# Altium schematic sheet CAN.SchDoc
size A4
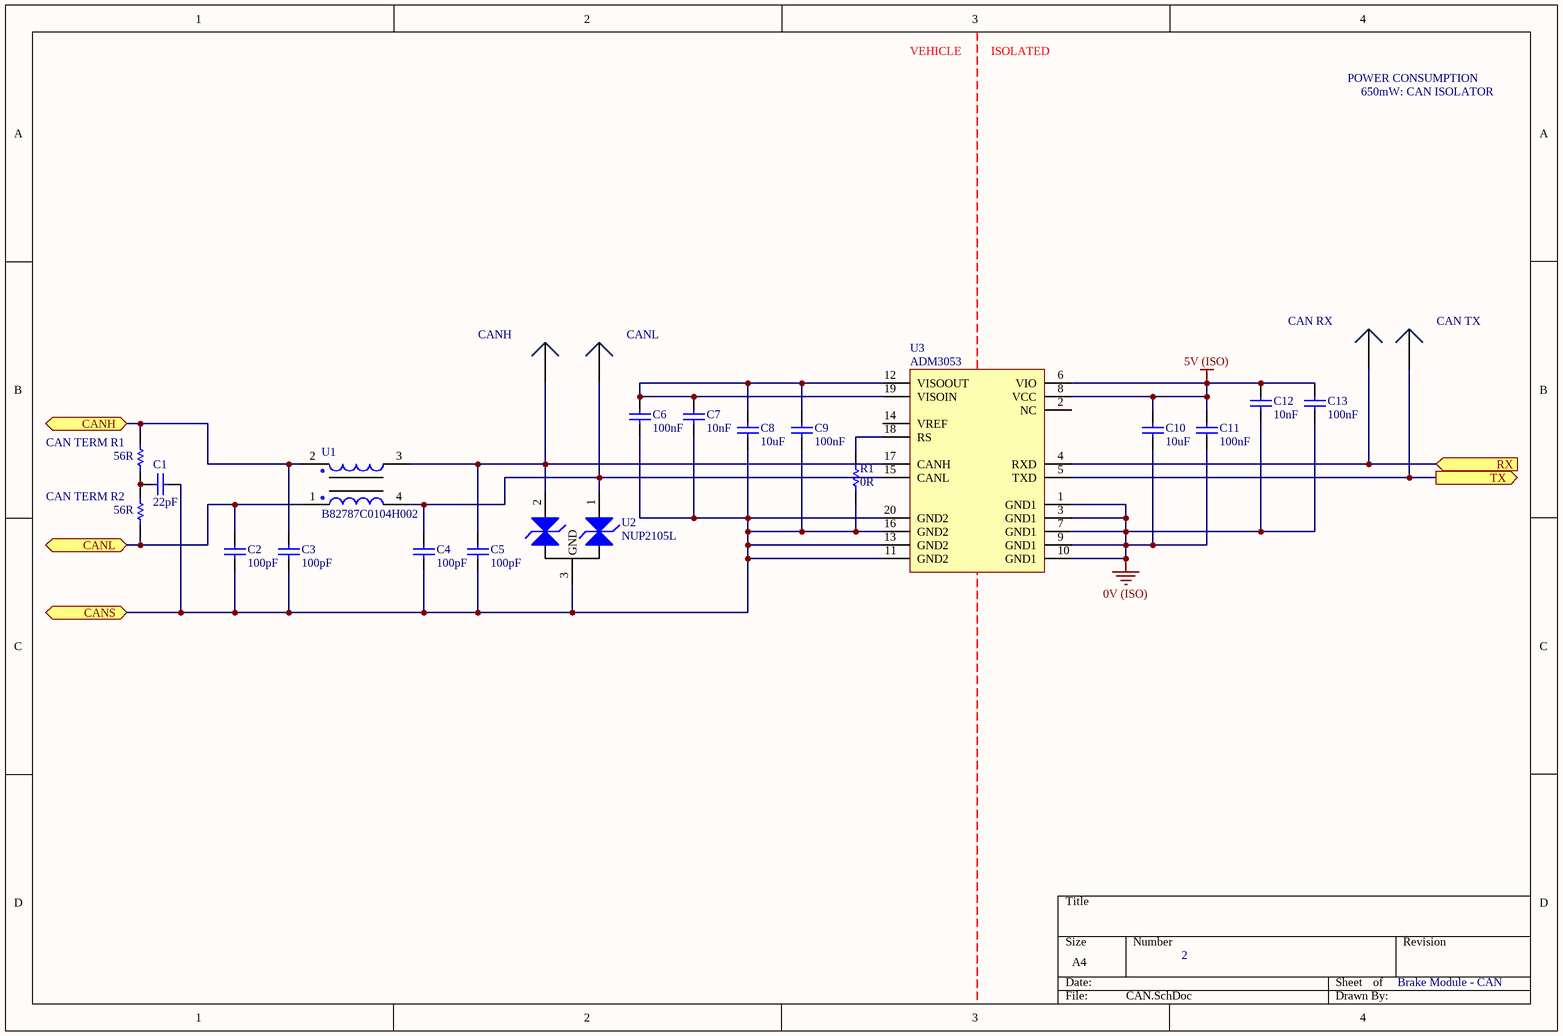
[diagram p0: CAN.SchDoc]

## Parts
C1  22pF  [0805]
C2  100pF  [0805]
C3  100pF  [0805]
C4  100pF  [0805]
C5  100pF  [0805]
C6  100nF  [0805]
C7  10nF  [1206]
C8  10uF  [0805]
C9  100nF  [0805]
C10  10uF  [0805]
C11  100nF  [0805]
C12  10nF  [1206]
C13  100nF  [0805]
CAN_RX  0mm  [SMD Test Point]  (value not drawn)
CAN_TERM_R1  56R  [0805]
CAN_TERM_R2  56R  [0805]
CAN_TX  0mm  [SMD Test Point]  (value not drawn)
CANH  0mm  [SMD Test Point]  (value not drawn)
CANL  0mm  [SMD Test Point]  (value not drawn)
R1  0R  [0805]
U1  B82787C0104H002  [TDK 4-PC Pad]
U2  NUP2105L  [ON SOT-23]
U3  ADM3053  [AD SOIC-W 20]

## Ports
CANH (bidir), CANL (bidir), CANS (bidir), RX (in), TX (out)

## Nets
0V (ISO): C10.1 C11.1 C12.1 C13.1 U3.1(GND1) U3.3(GND1) U3.7(GND1) U3.9(GND1) U3.10(GND1)
5V (ISO): C10.2 C11.2 C12.2 C13.2 U3.6(VIO) U3.8(VCC)
CANH: C3.2 CAN_TERM_R1.2 U1.2 ; port CANH
CANL: C2.2 CAN_TERM_R2.1 U1.1 ; port CANL
CANS: C1.2 C2.1 C3.1 C4.1 C5.1 C6.1 C7.1 C8.1 C9.1 R1.1 U2.3(GND) U3.11(GND2) U3.13(GND2) U3.16(GND2) U3.20(GND2) ; port CANS
RX: CAN_RX.1 U3.4(RXD) ; port RX
TX: CAN_TX.1 U3.5(TXD) ; port TX
NetC1_1: C1.1 CAN_TERM_R1.1 CAN_TERM_R2.2
NetC4_2: C4.2 CANL.1 U1.4 U2.1(CAN_H) U3.15(CANL)
NetC5_2: C5.2 CANH.1 U1.3 U2.2(CAN_L) U3.17(CANH)
NetC6_2: C6.2 C7.2 C8.2 C9.2 U3.12(VISOOUT) U3.19(VISOIN)
NetR1_2: R1.2 U3.18(RS)

Not connected (* = marked no-connect by the designer): U3 2(NC) 14(VREF)

## Notes on the sheet
- VEHICLE
- ISOLATED
- POWER CONSUMPTION
- 650mW: CAN ISOLATOR
- 2
- Brake Module - CAN

## Library data of the parts
C1 = GRM21A5C2E220JW01D: Manufacturer: muRata; Tolerance: ±5%; Material: C0G, NP0; Rated Voltage: 250V; Part Number: GRM21A5C2E220JW01D; Value: 22pF; Digikey Part Number: 490-5534-1-ND
C2-C5 = GCM2165C1H101JA16D: Manufacturer: muRata; Tolerance: ±5%; Material: C0G, NP0; Rated Voltage: 50V; Part Number: GCM2165C1H101JA16D; Value: 100pF; Digikey Part Number: 490-8031-1-ND
C6 C9 C11 C13 = GCM21BR71H104KA37L: Manufacturer: muRata; Tolerance: ±10%; Material: X7R; Rated Voltage: 50V; Part Number: GCM21BR71H104KA37L; Value: 100nF; Digikey Part Number: 490-6064-1-ND
C7 C12 = GCM3195C2A103JA16D: Manufacturer: muRata; Tolerance: 5%; Material: Ceramic; Rated Voltage: 100V; Part Number: GCM3195C2A103JA16D; Value: 10nF; Digikey Part Number: 490-4978-2-ND
C8 C10 = GRM21BR6YA106KE43L: Manufacturer: muRata; Tolerance: 10%; Material: X5R; Rated Voltage: 50V; Part Number: GRM21BR6YA106KE43L; Value: 10uF; Digikey Part Number: 490-10514-6-ND
CAN_RX CAN_TX CANH CANL = SMD Test Point: Positions: 1; Row Spacing: 0; Flange: No; Contact: NA; Part Number: SMD Test Point; Pitch: 0mm; Angle: 0
CAN_TERM_R1 CAN_TERM_R2 = RC0805FR0756RL: Manufacturer: YAGEO; Tolerance: 0.01; Rated Voltage: 0.125W; Part Number: RC0805FR0756RL; Value: 56R; Material: FR-07; Digikey Part Number: 311-56.0CRCT-ND
R1 = RC0805FR070RL: Manufacturer: YAGEO; Tolerance: 0.01; Rated Voltage: 0.125W; Part Number: RC0805FR070RL; Value: 0R; Material: FR-07; Digikey Part Number: 311-0.0CRCT-ND
U1 = B82787C0104H002: 100µH @ 100kHz 2 Line Common Mode Choke Surface Mount 5.8 kOhms @ 10MHz 150mA DCR 2Ohm; Manufacturer: EPCOS (TDK); Part Number: B82787C0104H002; Inductance: 100µH @ 100kHz; Impedence: 5.8 kOhms @ 10MHz; Material: Wirewound; Rated Current: 150mA; Digikey Part Number: 495-4598-1-ND; Digikey Link: https://www.digikey.com/product-detail/en/epcos-tdk/B82787C0104H002/495-4598-2-ND/3680998
U2 = NUP2105L: Dual Line CAN Bus Protector; Manufacturer: ON Semiconductor; Part Number: NUP2105L; Digikey Part Number: NUP2105LT1GOSCT-ND; Digikey Link: https://www.digikey.com/product-detail/en/on-semiconductor/NUP2105LT1G/NUP2105LT1GOSCT-ND/1485001
U3 = ADM3053: Isolated CAN Transceiver; Manufacturer: Analogue Devices; Part Number: ADM3053; Digikey Part Number: ADM3053BRWZ-ND; Digikey Link: https://www.digikey.com/product-detail/en/analog-devices-inc/ADM3053BRWZ/ADM3053BRWZ-ND/2709332